# EAGLE design reader_v1 (EAGLE 9.0.1)
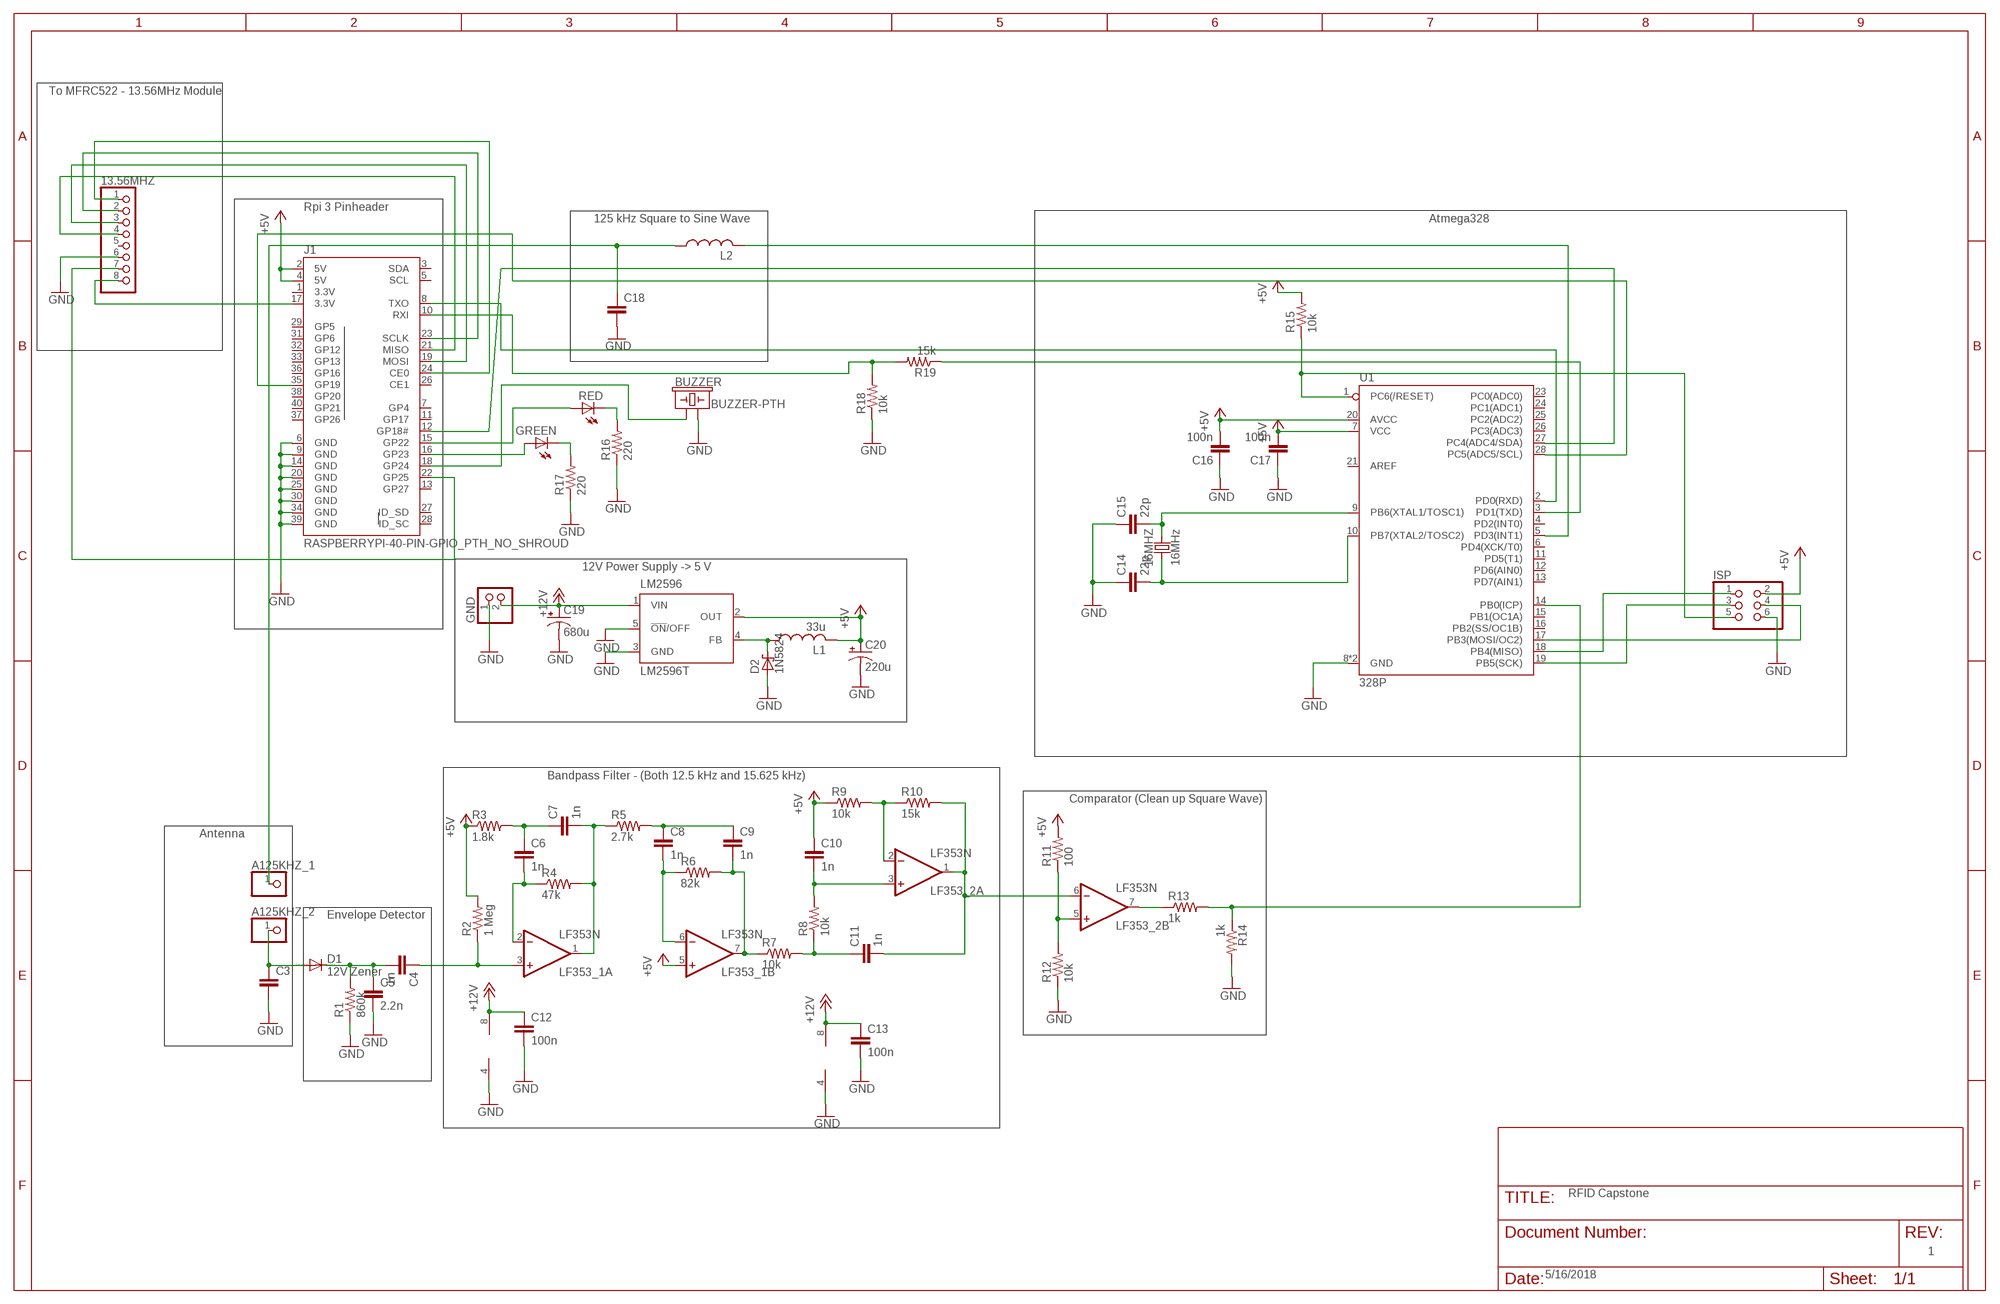
[diagram p0: schematic, sheet 1]

## Parts
13.56MHZ  PINHD-1X8  [1X08]
16MHZ  16MHz  CRYSTAL-16MHZPTH-HC49US  [HC49US]
A125KHZ_1  PINHD-1X1  [1X01]
A125KHZ_2  PINHD-1X1  [1X01]
BUZZER  BUZZER-PTH  [BUZZER-12MM]
C3  C-EUC0805  [C0805]
C4  1n  C-EUC0805  [C0805]
C5  2.2n  C-EUC0805  [C0805]
C6  1n  C-EUC0805  [C0805]
C7  1n  C-EUC0805  [C0805]
C8  1n  C-EUC0805  [C0805]
C9  1n  C-EUC0805  [C0805]
C10  1n  C-EUC0805  [C0805]
C11  1n  C-EUC0805  [C0805]
C12  100n  C-EUC0805  [C0805]
C13  100n  C-EUC0805  [C0805]
C14  22p  C-EUC0805  [C0805]
C15  22p  C-EUC0805  [C0805]
C16  100n  C-EUC0805  [C0805]
C17  100n  C-EUC0805  [C0805]
C18  C-EUC0805  [C0805]
C19  680u  CPOL-USE3.5-8  [E3,5-8]
C20  220u  CPOL-USE2-5  [E2-5]
D1  12V Zener  1N4148DO35-7  [DO35-7]
D2  1N5824  SCHOTTKY-DIODEDO35-7  [DO35-7]
GND  PINHD-1X2  [1X02]
GREEN  LED5MM  [LED5MM]
ISP  PINHD-2X3  [2X03]
J1  RASPBERRYPI-40-PIN-GPIO_PTH_NO_SHROUD  [2X20]
L1  33u  L-US0207/10  [0207/10]
L2  L-US0207/10  [0207/10]
LF353_1  LF353N  [DIL08]
LF353_2  LF353N  [DIL08]
LM2596  LM2596T  [T05D]
R1  860k  R-US_R0805  [R0805]
R2  1 Meg  R-US_R0805  [R0805]
R3  1.8k  R-US_R0805  [R0805]
R4  47k  R-US_R0805  [R0805]
R5  2.7k  R-US_R0805  [R0805]
R6  82k  R-US_R0805  [R0805]
R7  10k  R-US_R0805  [R0805]
R8  10k  R-US_R0805  [R0805]
R9  10k  R-US_R0805  [R0805]
R10  15k  R-US_R0805  [R0805]
R11  100  R-US_R0805  [R0805]
R12  10k  R-US_R0805  [R0805]
R13  1k  R-US_R0805  [R0805]
R14  1k  R-US_R0805  [R0805]
R15  10k  R-US_R0805  [R0805]
R16  220  R-US_R0805  [R0805]
R17  220  R-US_R0805  [R0805]
R18  10k  R-US_R0805  [R0805]
R19  15k  R-US_R0805  [R0805]
RED  LED5MM  [LED5MM]
U1  328P  ATMEGA328P_PDIP  [DIP28]

## Nets
+5V: C10.1 C16.2 C17.2 C20.+ ISP.2 J1.2(5V) J1.4(5V) L1.2 LF353_1.5(B:+IN) LM2596.2(OUT) R2.2 R3.1 R9.1 R11.2 R15.2 U1.7(VCC) U1.20(AVCC)
+12V: C12.1 C13.1 C19.+ GND.2 LF353_1.8(P:V+) LF353_2.8(P:V+) LM2596.1(VIN)
GND: 13.56MHZ.6 BUZZER.- C3.2 C5.2 C12.2 C13.2 C14.1 C15.1 C16.1 C17.1 C18.2 C19.- C20.- D2.A GND.1 ISP.6 J1.6(GND) J1.9(GND) J1.14(GND) J1.20(GND) J1.25(GND) J1.30(GND) J1.34(GND) J1.39(GND) LF353_1.4(P:V-) LF353_2.4(P:V-) LM2596.3(GND) LM2596.5(!ON!/OFF) R1.1 R12.1 R14.2 R16.1 R17.1 R18.1 U1.8(GND) U1.22(GND)
N$1: C4.2 C5.1 D1.C R1.2
N$2: C4.1 LF353_1.3(A:+IN) R2.1
N$3: D2.C L1.1 LM2596.4(FB)
N$4: A125KHZ_2.1 C3.1 D1.A
N$5: ISP.1 U1.18(PB4(MISO))
N$6: C6.1 C7.1 R3.2
N$7: C6.2 LF353_1.2(A:-IN) R4.1
N$8: C8.1 C9.1 R5.2
N$9: C7.2 LF353_1.1(A:OUT) R4.2 R5.1
N$10: C8.2 LF353_1.6(B:-IN) R6.1
N$11: C9.2 LF353_1.7(B:OUT) R6.2 R7.1
N$12: C11.1 R7.2 R8.1
N$13: C10.2 LF353_2.3(A:+IN) R8.2
N$14: 16MHZ.1 C14.2 U1.10(PB7(XTAL2/TOSC2))
N$15: LF353_2.2(A:-IN) R9.2 R10.1
N$16: C11.2 LF353_2.1(A:OUT) LF353_2.6(B:-IN) R10.2
N$17: 16MHZ.2 C15.2 U1.9(PB6(XTAL1/TOSC1))
N$18: LF353_2.5(B:+IN) R11.1 R12.2
N$19: LF353_2.7(B:OUT) R13.1
N$20: R13.2 R14.1 U1.14(PB0(ICP))
N$21: ISP.5 R15.1 U1.1(PC6(/RESET))
N$22: ISP.3 U1.19(PB5(SCK))
N$23: ISP.4 U1.17(PB3(MOSI/OC2))
N$24: A125KHZ_1.1 C18.1 L2.1
N$25: 13.56MHZ.8 J1.17(3.3V)
N$26: J1.12(GP18#) U1.27(PC4(ADC4/SDA))
N$27: J1.35(GP19) U1.28(PC5(ADC5/SCL))
N$28: L2.2 U1.5(PD3(INT1))
N$29: 13.56MHZ.7 J1.22(GP25)
N$30: R16.2 RED.K(C)
N$31: 13.56MHZ.4 J1.21(MISO)
N$32: 13.56MHZ.3 J1.19(MOSI)
N$33: 13.56MHZ.2 J1.23(SCLK)
N$34: 13.56MHZ.1 J1.24(CE0)
N$35: GREEN.K(C) R17.2
N$36: GREEN.A J1.16(GP23)
N$37: J1.15(GP22) RED.A
N$38: BUZZER.+ J1.18(GP24)
N$39: J1.10(RXI) R18.2 R19.2
N$40: R19.1 U1.3(PD1(TXD))
N$41: J1.8(TXO) U1.2(PD0(RXD))
Unconnected: 13.56MHZ.5 J1.3(SDA) J1.5(SCL) J1.7(GP4) J1.11(GP17) J1.13(GP27) J1.26(CE1) J1.27(ID_SD) J1.28(ID_SC) J1.29(GP5) J1.31(GP6) J1.32(GP12) J1.33(GP13) J1.36(GP16) J1.37(GP26) J1.38(GP20) J1.40(GP21) U1.4(PD2(INT0)) U1.6(PD4(XCK/T0)) U1.11(PD5(T1)) U1.12(PD6(AIN0)) U1.13(PD7(AIN1)) U1.15(PB1(OC1A)) U1.16(PB2(SS/OC1B)) U1.21(AREF) U1.23(PC0(ADC0)) U1.24(PC1(ADC1)) U1.25(PC2(ADC2)) U1.26(PC3(ADC3))

## Notes on the sheet
- To MFRC522 - 13.56MHz Module
- Rpi 3 Pinheader
- 125 kHz Square to Sine Wave | Atmega328
- 12V Power Supply -> 5 V
- Bandpass Filter - (Both 12.5 kHz and 15.625 kHz)
- Comparator (Clean up Square Wave)
- Antenna
- Envelope Detector
- RFID Capstone
- 1
- 5/16/2018

## Power pins joined to a net without a drawn wire
3.3V: J1.1(3.3V)

## Library data of the parts
13.56MHZ = pinhead:PINHD-1X8: PIN HEADER
16MHZ = SparkFun-Clocks:CRYSTAL-16MHZ: 16MHz Crystal Digikey Example <http://www.digikey.com/product-search/en?keywords=535-9122-1-ND> Frequency: 16MHz Frequency Stability: ±50ppm Frequency Tolerance: ±20ppm Load Capacitance: 18pF SparkFun Products: Pro Micro -5V/16MHz <https://www.sparkfun.com/products/12640> SparkFun Serial Enabled LCD Kit <https://www.sparkfun.com/products/10097>; PROD_ID: XTAL-08181; SF_ID: COM-00536
A125KHZ_1 A125KHZ_2 = pinhead:PINHD-1X1: PIN HEADER
BUZZER = SparkFun-Electromechanical:BUZZER: Buzzer Small round buzzers that operate around the audible 2kHz range. You can use these as speakers to create simple music or user interfaces. Variant Overview: PTH - Mini Speaker - PC Mount 12mm 2.048kHz <https://www.sparkfun.com/products/7950> PTH_KIT - Mini Speaker - PC Mount 12mm 2.048kHz <https://www.sparkfun.com/products/7950> KIT simplifies soldering by adding stop mask to one side of the pads. PTH_NO_SILK - Mini Speaker - PC Mount 12mm 2.048kHz <https://www.sparkfun.com/products/7950> No silkscreen indicator of buzzer outline. PTH_KIT_NO_SILK - Mini Speaker - PC Mount 12mm 2.048kHz <https://www.sparkfun.com/products/7950> KIT package w/o silkscreen SMD - Buzzer Audio Magnetic (CCV-084B16) SMD buzzer used on, e.g. the LilyPad Buzzer <https://www.sparkfun.com/products/8463> and RFID USB Reader <https://www.sparkfun.com/products/9963>. SMD_KIT - Buzzer Audio Magnetic (CCV-084B16) SMD Buzzer with elongated pins to make soldering easier. Used on the SparkFun Simon Says - Surface Mount Soldering Kit <https://www.sparkfun.com/products/10935>.; PROD_ID: COMP-08253; SF_SKU: COM-07950
C3-C18 = rcl:C-EU: CAPACITOR, European symbol; SPICEPREFIX: C
C19 C20 = rcl:CPOL-US: POLARIZED CAPACITOR, American symbol; SPICEPREFIX: C
D1 = diode:1N4148: DIODE high speed (Philips)
D2 = diode:SCHOTTKY-DIODE: Schottky Diode
GND = pinhead:PINHD-1X2: PIN HEADER
GREEN RED = led:LED: LED OSRAM: - CHIPLED LG R971, LG N971, LY N971, LG Q971, LY Q971, LO R971, LY R971 LH N974, LH R974 LS Q976, LO Q976, LY Q976 LO Q996 - Hyper CHIPLED LW Q18S LB Q993, LB Q99A, LB R99A - SideLED LS A670, LO A670, LY A670, LG A670, LP A670 LB A673, LV A673, LT A673, LW A673 LH A674 LY A675 LS A676, LA A676, LO A676, LY A676, LW A676 LS A679, LY A679, LG A679 - Hyper Micro SIDELED® LS Y876, LA Y876, LO Y876, LY Y876 LT Y87S - SmartLED LW L88C, LW L88S LB L89C, LB L89S, LG L890 LS L89K, LO L89K, LY L89K LS L896, LA L896, LO L896, LY L896 - TOPLED LS T670, LO T670, LY T670, LG T670, LP T670 LSG T670, LSP T670, LSY T670, LOP T670, LYG T670 LG T671, LOG T671, LSG T671 LB T673, LV T673, LT T673, LW T673 LH T674 LS T676, LA T676, LO T676, LY T676, LB T676, LH T676, LSB T676, LW T676 LB T67C, LV T67C, LT T67C, LS T67K, LO T67K, LY T67K, LW E67C LS E67B, LA E67B, LO E67B, LY E67B, LB E67C, LV E67C, LT E67C LW T67C LS T679, LY T679, LG T679 LS T770, LO T770, LY T770, LG T770, LP T770 LB T773, LV T773, LT T773, LW T773 LH T774 LS E675, LA E675, LY E675, LS T675 LS T776, LA T776, LO T776, LY T776, LB T776 LHGB T686 LT T68C, LB T68C - Hyper Mini TOPLED® LB M676 - Mini TOPLED Santana® LG M470 LS M47K, LO M47K, LY M47K Source: http://www.osram.convergy.de LUXEON: - LUMILED® LXK2-PW12-R00, LXK2-PW12-S00, LXK2-PW14-U00, LXK2-PW14-V00 LXK2-PM12-R00, LXK2-PM12-S00, LXK2-PM14-U00 LXK2-PE12-Q00, LXK2-PE12-R00, LXK2-PE12-S00, LXK2-PE14-T00, LXK2-PE14-U00 LXK2-PB12-K00, LXK2-PB12-L00, LXK2-PB12-M00, LXK2-PB14-N00, LXK2-PB14-P00, LXK2-PB14-Q00 LXK2-PR12-L00, LXK2-PR12-M00, LXK2-PR14-Q00, LXK2-PR14-R00 LXK2-PD12-Q00, LXK2-PD12-R00, LXK2-PD12-S00 LXK2-PH12-R00, LXK2-PH12-S00 LXK2-PL12-P00, LXK2-PL12-Q00, LXK2-PL12-R00 Source: www.luxeon.com KINGBRIGHT: KA-3528ASYC Source: www.kingbright.com
ISP = pinhead:PINHD-2X3: PIN HEADER
J1 = SparkFun-Connectors:RASPBERRYPI-40-PIN-GPIO: Raspberry Pi GPIO Header 2x20 pin connector, as found on B, B+, A+ models. Both shrouded PTH and SMT versions available. SparkFun Products: GPIO Shrouded Header <https://www.sparkfun.com/products/13054>- PTH SparkFun Pi Wedge (Preassembled) <https://www.sparkfun.com/products/13717>
L1 L2 = rcl:L-US: INDUCTOR, American symbol; SPICEPREFIX: L
LF353_1 = linear:LF353: OP AMP; SPICEPREFIX: J
LF353_2 = linear:LF353: OP AMP
LM2596 = national-semiconductor:LM2596: SIMPLE SWITCHER® Power Converter 150 kHz 3A Step-Down Voltage Regulator Source: http://www.national.com/ds/LM/LM2596.pdf; MPN: LM2596T-ADJ/LF02; OC_FARNELL: 9494162; OC_NEWARK: 65K5910
R1-R19 = rcl:R-US_: RESISTOR, American symbol; SPICEPREFIX: R
U1 = SparkFun-IC-Microcontroller:ATMEGA328P_PDIP: Atmel 328P Through hole ATMEGA328P uC used in the Arduino 32kb flash, 1k EEPROM, 2k SRAM Datasheet <http://www.sparkfun.com/datasheets/Components/SMD/ATMega328.pdf> SparkFun Products Storefront component: AVR 28 Pin 20MHz 32K 6A/D - ATMega328P <https://www.sparkfun.com/products/9061> (COM-09061) SparkFun Simon Says - Through-Hole Soldering Kit <https://www.sparkfun.com/products/10547> (KIT-10547) SparkFun Learn to Solder - Simon Says <https://www.sparkfun.com/products/13708> (KIT-13708) SparkFun BigTime Watch Kit <https://www.sparkfun.com/products/11734> (KIT-11734) SparkFun ClockIt <https://www.sparkfun.com/products/10930> (KIT-10930) SparkFun Serial Enabled LCD Kit <https://www.sparkfun.com/products/10097> (LCD-10097) SparkFun Simon Tilts - Through Hole Soldering Kit <https://www.sparkfun.com/products/12634> (KIT-12634) SparkFun Frequency Counter Kit <https://www.sparkfun.com/products/10140> (KIT-10140) FabFM Radio Kit <https://www.sparkfun.com/products/11043> (KIT-11043) SparkFun Binary Blaster Kit <https://www.sparkfun.com/products/12037> (KIT-12037) SparkFun Metro-Gnome <https://www.sparkfun.com/products/9236> (KIT-09236) ATmega328 with Arduino Optiboot (Uno) <https://www.sparkfun.com/products/10524> (DEV-10524); PROD_ID: IC-09136

## Module LF353X
Ports: 

### Library data of the parts

## Board
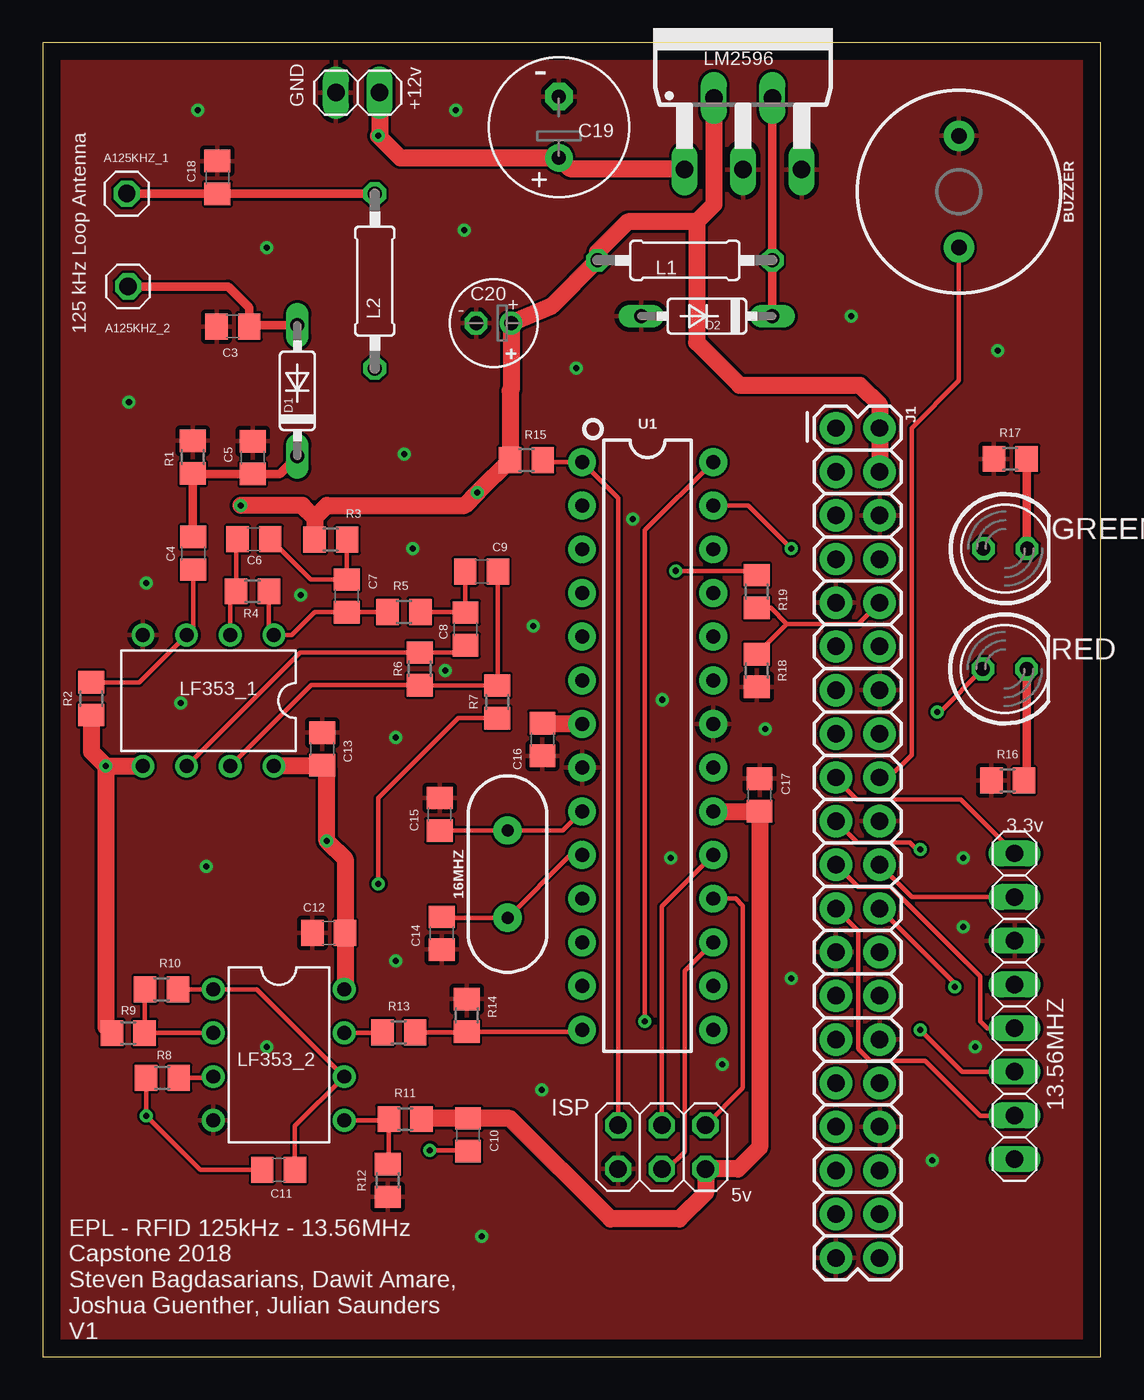
[diagram p1: board, top side]
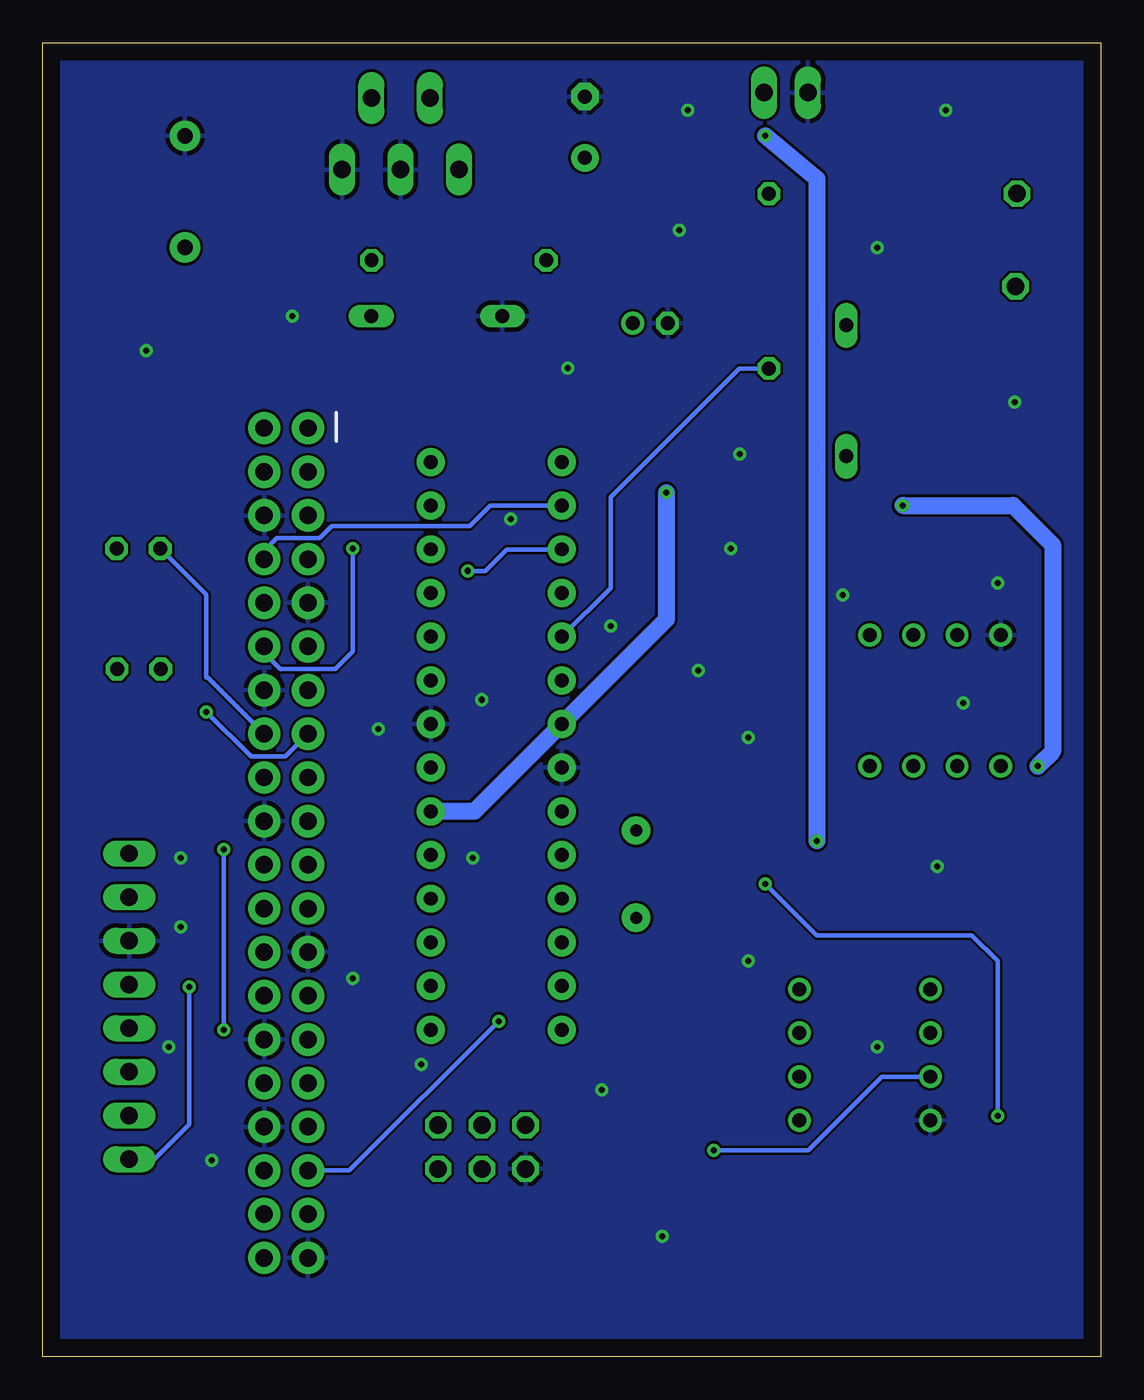
[diagram p2: board, bottom side, seen from below]

Size 61.5 x 76.4 mm. Coordinates in mm from the lower left corner, seen from the top.
Outline: 0,0 61.5,0 61.5,76.4 0,76.4 0,0
Copper layers (1*16): Top 0.035mm / dielectric 1.5mm / Bottom 0.035mm
Design rules "default": minimum track width 6mil, minimum drill 0.35mm, track to track 6mil, track to pad 6mil, pad to pad 6mil, via to via 6mil, smd to smd 6mil, copper to edge 40mil, drill to drill 6mil, minimum pad ring 10mil, minimum via ring 8mil, stop-mask expansion 4mil, vias tented up to drill 0mil, thermal gap 10mil

### Footprints (pad centres in the part's own frame; a part is rotated, then mirrored left to right if it is on the bottom)
1X08 = drill 1.016 long: 1 -8.89,0; 2 -6.35,0; 3 -3.81,0; 4 -1.27,0; 5 1.27,0; 6 3.81,0; 7 6.35,0; 8 8.89,0
HC49US = drill 0.7 pad 1.651: 1 -2.54,0; 2 2.54,0
1X01 = drill 1.016 octagon: 1 0,0
BUZZER-12MM = drill 0.9 pad 1.778: + 3.25,0; - -3.25,0
C0805 = smd 1.3 x 1.5: 1 -0.95,0; 2 0.95,0
E3,5-8 = drill 0.813 pad 1.6: + -1.778,0 | drill 0.813 pad 1.6 octagon: - 1.778,0
E2-5 = drill 0.813 pad 1.27: + -1.016,0 | drill 0.813 pad 1.27 octagon: - 1.016,0
DO35-7 = drill 0.813 long: A 3.81,0; C -3.81,0
1X02 = drill 1.016 long: 1 -1.27,0; 2 1.27,0
LED5MM = drill 0.813 octagon: A -1.27,0; K 1.27,0
2X03 = drill 1.016 octagon: 1 -2.54,-1.27; 2 -2.54,1.27; 3 0,-1.27; 4 0,1.27; 5 2.54,-1.27; 6 2.54,1.27
2X20 = drill 1.016 pad 1.88: 1 0,0; 2 0,2.54; 3 2.54,0; 4 2.54,2.54; 5 5.08,0; 6 5.08,2.54; 7 7.62,0; 8 7.62,2.54; 9 10.16,0; 10 10.16,2.54; 11 12.7,0; 12 12.7,2.54; 13 15.24,0; 14 15.24,2.54; 15 17.78,0; 16 17.78,2.54; 17 20.32,0; 18 20.32,2.54; 19 22.86,0; 20 22.86,2.54; 21 25.4,0; 22 25.4,2.54; 23 27.94,0; 24 27.94,2.54; 25 30.48,0; 26 30.48,2.54; 27 33.02,0; 28 33.02,2.54; 29 35.56,0; 30 35.56,2.54; 31 38.1,0; 32 38.1,2.54; 33 40.64,0; 34 40.64,2.54; 35 43.18,0; 36 43.18,2.54; 37 45.72,0; 38 45.72,2.54; 39 48.26,0; 40 48.26,2.54
0207/10 = drill 0.813 octagon: 1 -5.08,0; 2 5.08,0
DIL08 = drill 0.813 pad 1.27: 1 -3.81,-3.81; 2 -1.27,-3.81; 3 1.27,-3.81; 4 3.81,-3.81; 5 3.81,3.81; 6 1.27,3.81; 7 -1.27,3.81; 8 -3.81,3.81
T05D = drill 1.016 long: 1 -3.404,-5.08; 2 -1.702,-0.914; 3 0,-5.08; 4 1.702,-0.914; 5 3.404,-5.08
R0805 = smd 1.3 x 1.5: 1 -0.95,0; 2 0.95,0
DIP28 = drill 0.813 pad 1.626: 1 -16.51,-3.81; 2 -13.97,-3.81; 3 -11.43,-3.81; 4 -8.89,-3.81; 5 -6.35,-3.81; 6 -3.81,-3.81; 7 -1.27,-3.81; 8 1.27,-3.81; 9 3.81,-3.81; 10 6.35,-3.81; 11 8.89,-3.81; 12 11.43,-3.81; 13 13.97,-3.81; 14 16.51,-3.81; 15 16.51,3.81; 16 13.97,3.81; 17 11.43,3.81; 18 8.89,3.81; 19 6.35,3.81; 20 3.81,3.81; 21 1.27,3.81; 22 -1.27,3.81; 23 -3.81,3.81; 24 -6.35,3.81; 25 -8.89,3.81; 26 -11.43,3.81; 27 -13.97,3.81; 28 -16.51,3.81

### Placement (x,y rotation side)
13.56MHZ  56.49,20.37 90 top
16MHZ  27.01,28.06 90 top
A125KHZ_1  4.87,67.64 0 top
A125KHZ_2  4.95,62.24 0 top
BUZZER  53.25,67.75 270 top
C3  11.04,59.91 180 top
C4  8.74,46.72 90 top
C5  12.19,52.28 90 top
C6  12.26,47.54 180 top
C7  17.66,44.24 270 top
C8  24.56,42.32 270 top
C9  25.5,45.66 0 top
C10  24.71,12.9 270 top
C11  13.7,10.86 0 top
C12  16.61,24.64 180 top
C13  16.24,35.34 90 top
C14  23.19,24.62 90 top
C15  23.06,31.54 270 top
C16  29.04,35.89 90 top
C17  41.66,32.66 270 top
C18  10.14,68.58 90 top
C19  30,71.5 90 top
C20  26.2,60.1 180 top
D1  14.79,56.17 90 top
D2  38.6,60.51 180 top
GND  18.3,73.51 0 top
GREEN  55.95,46.99 0 top
ISP  35.98,12.18 180 top
J1  46.1,54 270 top
L1  37.32,63.76 180 top
L2  19.29,62.55 270 top
LF353_1  9.62,38.15 180 top
LF353_2  13.71,17.55 270 top
LM2596  40.71,74.12 0 top
R1  8.71,52.31 270 top
R2  2.81,38.26 270 top
R3  16.74,47.51 0 top
R4  12.18,44.51 0 top
R5  20.99,43.31 0 top
R6  21.91,40 270 top
R7  26.41,38.08 270 top
R8  6.94,16.21 0 top
R9  4.96,18.81 0 top
R10  6.89,21.36 0 top
R11  21.06,13.81 0 top
R12  20.04,10.24 90 top
R13  20.69,18.86 0 top
R14  24.64,19.84 90 top
R15  28.11,52.14 180 top
R16  56.09,33.51 0 top
R17  56.24,52.21 0 top
R18  41.5,39.9 90 top
R19  41.5,44.5 270 top
RED  55.92,39.99 0 top
U1  35.15,35.52 270 top

### Tracks (layer width: path | path; a pad name or v marks a point on that pad's centre or on a via)
+5V  (via drill 0.35)
  Top 1: LM2596.2 39.01,67.01 38,66 | 38,66 34,66 32.24,64.24 L1.2 29.58,61.1 C20.+ 27.22,56.22 27.16,56.16 R15.2 v25.26,50.24 24.52,49.5 16.5,49.5 15.79,48.79 | 15.79,48.79 R3.1 | 15.79,48.79 15.08,49.5 v11.5,49.5 | R2.2 2.81,35.19 v3.66,34.34 | v3.66,34.34 LF353_1.5 | v3.66,34.34 3.66,19.16 R9.1 | U1.7 29.09,36.79 C16.2 | U1.20 C17.2 41.66,12.16 40.41,10.91 ISP.2 38.52,9.52 37,8 33,8 27.15,13.85 C10.1 22.05,13.85 R11.2 | 38,66 38,59 40.5,56.5 47.5,56.5 48.64,55.36 J1.2 J1.4
  Bottom 1: v25.26,50.24 25.26,42.87 U1.7 36.42,31.71 U1.20 | v11.5,49.5 5.1,49.5 2.8,47.2 2.8,35.2 v3.66,34.34
+12V  (via drill 0.35)
  Top 1: LM2596.1 37.26,69.09 30.63,69.09 C19.+ 20.78,69.72 v19.5,71 19.57,71.07 GND.2 | LF353_1.8 16.19,34.34 C13.1 16.5,34.13 v16.5,30 17.56,28.94 C12.1 17.56,21.4 LF353_2.8
  Bottom 1: v19.5,71 16.5,68.5 v16.5,30
GND  (via drill 0.35)
  other vias: 28.5,42.5 39.5,17 36.5,29 43.5,22 54.2,18 51.7,11.4 31,57.5 42,36.5 53.5,29 53.5,25 29,15.5 20.5,23 20.5,36 9.5,28.5 5,55.5 13,64.5 24.5,65.5 21,52.5 36,38.2 25.5,7 13,18 8,38 47,60.5 55.5,58.5 24,72.5 9,72.5 21.5,47 15,44.3 6,45 23.4,39.9 34.3,48.7
  pour Top: 0,73.5 0,0 61.5,0 61.5,76.4 0.5,76.4
  pour Bottom: 0,76.5 0,0 61.5,0 61.5,76.5
N$1
  Top 0.5: D1.C 13.76,51.33 C5.1 8.74,51.33 R1.2 8.71,47.7 C4.2
N$2
  Top 0.25: C4.1 8.74,42.35 LF353_1.3 5.6,39.21 R2.1
N$3
  Top 0.5: LM2596.4 42.41,63.77 L1.1 D2.C
N$4
  Top 0.5: A125KHZ_2.1 10.76,62.24 11.99,61.01 C3.1 12.06,59.98 D1.A
N$5
  Top 0.25: ISP.1 40.7,15.63 40.7,26.2 40.27,26.63 U1.18
N$6
  Top 0.25: C6.1 15.56,45.19 C7.1 17.66,47.48 R3.2
N$7
  Top 0.25: LF353_1.2 10.89,44.17 R4.1 11.23,47.46 C6.2
N$8
  Top 0.25: R5.2 24.52,43.31 C8.1 C9.1
N$9
  Top 0.25: R4.2 13.13,42.26 LF353_1.1 14.46,41.96 15.8,43.3 C7.2 20.02,43.29 R5.1
N$10
  Top 0.25: C8.2 24.14,40.95 R6.1 14.96,40.95 LF353_1.6
N$11
  Top 0.25: C9.2 26.45,39.07 R7.1 21.93,39.03 R6.2 15.6,39.05 LF353_1.7
N$12  (via drill 0.35)
  Top 0.25: C11.1 9.14,10.86 v6,14 R8.1 | R7.2 24.13,37.13 19.5,32.5 v19.5,27.5
  Bottom 0.25: v19.5,27.5 16.5,24.5 7.5,24.5 6,23 v6,14
N$13  (via drill 0.35)
  Top 0.25: R8.2 9.83,16.21 LF353_2.3 | v22.5,12 24.66,12 C10.2
  Bottom 0.25: LF353_2.3 12.72,16.28 17,12 v22.5,12
N$14
  Top 0.25: U1.10 30.66,29.17 16MHZ.1 23.24,25.52 C14.2
N$15
  Top 0.25: R10.1 5.91,21.33 R9.2 LF353_2.2
N$16
  Top 0.25: R10.2 LF353_2.1 12.44,21.36 LF353_2.6 14.65,13.41 C11.2
N$17
  Top 0.25: U1.9 30.23,30.6 16MHZ.2 C15.2
N$18
  Top 0.25: LF353_2.5 20.04,13.74 R11.1 20.11,11.26 R12.2
N$19
  Top 0.25: LF353_2.7 19.7,18.82 R13.1
N$20
  Top 0.25: R13.2 24.61,18.86 R14.1 31.22,18.89 U1.14
N$21
  Top 0.25: ISP.5 33.44,49.93 U1.1 29.17,52.03 R15.1
N$22
  Top 0.25: U1.19 35.98,26.19 ISP.3
N$23
  Top 0.25: U1.17 37.3,22.43 37.3,11.9 36.31,10.91 ISP.4
N$24
  Top 0.5: A125KHZ_1.1 C18.1 L2.1
N$25
  Top 0.25: 13.56MHZ.8 53.35,32.4 47.3,32.4 46.1,33.6 J1.17
N$26  (via drill 0.35)
  Top 0.25: U1.27 41.01,49.49 v43.5,47
  Bottom 0.25: v43.5,47 43.5,41 44.5,40 47.7,40 48.64,40.94 J1.12
N$27  (via drill 0.35)
  Top 0.25: U1.28 35,48.07 v35,19.5
  Bottom 0.25: v35,19.5 43.68,10.82 J1.35
N$28
  Bottom 0.25: U1.5 28.5,44.71 28.5,50 21.03,57.47 L2.2
N$29
  Top 0.25: J1.22 50.52,26.72 13.56MHZ.7
N$30
  Top 0.5: RED.K 57.19,33.66 R16.2
N$31
  Top 0.25: J1.21 47.4,27.3 49.3,27.3 54.5,22.1 54.5,19.5 54.9,19.1 13.56MHZ.4
N$32  (via drill 0.35)
  Top 0.25: J1.19 47.34,29.9 50.4,29.9 51,29.3 v51,29.5 | v51,19 53.44,16.56 13.56MHZ.3
  Bottom 0.25: v51,29.5 v51,19
N$33
  Top 0.25: J1.23 47.4,24.76 47.4,17.9 48.1,17.2 51.3,17.2 54.5,14 56.47,14 13.56MHZ.2
N$34  (via drill 0.35)
  Top 0.25: J1.24 53,21.7 v53,21.5
  Bottom 0.25: v53,21.5 53,13.5 55.02,11.48 13.56MHZ.1
N$35
  Top 0.5: R17.2 57.19,47.02 GREEN.K
N$36
  Bottom 0.25: J1.16 51.92,39.5 52,39.5 52,44.31 GREEN.A
N$37  (via drill 0.35)
  Top 0.25: RED.A 52.16,37.5 v52,37.5
  Bottom 0.25: v52,37.5 49.4,34.9 47.42,34.9 J1.15
N$38
  Top 0.25: BUZZER.+ 53.25,56.75 50.5,54 50.5,35 49.18,33.68 J1.18
N$39
  Top 0.25: J1.10 47.4,42.6 43.25,42.6 | 43.25,42.6 R18.2 | 43.25,42.6 42.3,43.55 R19.2
N$40  (via drill 0.35)
  Top 0.25: v36.8,45.7 41.25,45.7 R19.1
  Bottom 0.25: U1.3 34.55,46.95 35.8,45.7 v36.8,45.7
N$41
  Bottom 0.25: U1.2 35.51,49.49 36.7,48.3 44.7,48.3 45.4,47.6 47.9,47.6 48.64,46.86 J1.8

### Text on the board
tNames: - | +12v | + | 125 kHz Loop Antenna | - | 3.3v | 5v | EPL - RFID 125kHz - 13.56MHz / Capstone 2018 / Steven Bagdasarians, Dawit Amare, / Joshua Guenther, Julian Saunders / V1